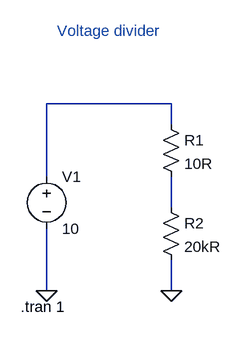
[diagram p0: schematic Draft2.asc]
Draft2.asc, the LTspice schematic file:
Version 4.1
SHEET 1 880 680
WIRE 256 16 64 16
WIRE 256 48 256 16
WIRE 64 128 64 16
WIRE 256 176 256 128
WIRE 64 304 64 208
WIRE 256 304 256 256
FLAG 64 304 0
FLAG 256 304 0
SYMBOL voltage 64 112 R0
WINDOW 123 0 0 Left 0
WINDOW 39 0 0 Left 0
SYMATTR InstName V1
SYMATTR Value 10
SYMBOL res 240 32 R0
SYMATTR InstName R1
SYMATTR Value 10R
SYMBOL res 240 160 R0
SYMATTR InstName R2
SYMATTR Value 20kR
TEXT 80 -96 Left 2 ;Voltage divider
TEXT 24 328 Left 2 !.tran 1

The netlist it stands for:
* Draft2.asc
V1 N001 0 10
R1 N001 N002 10R
R2 N002 0 20kR
* Voltage divider
.tran 1
.backanno
.end